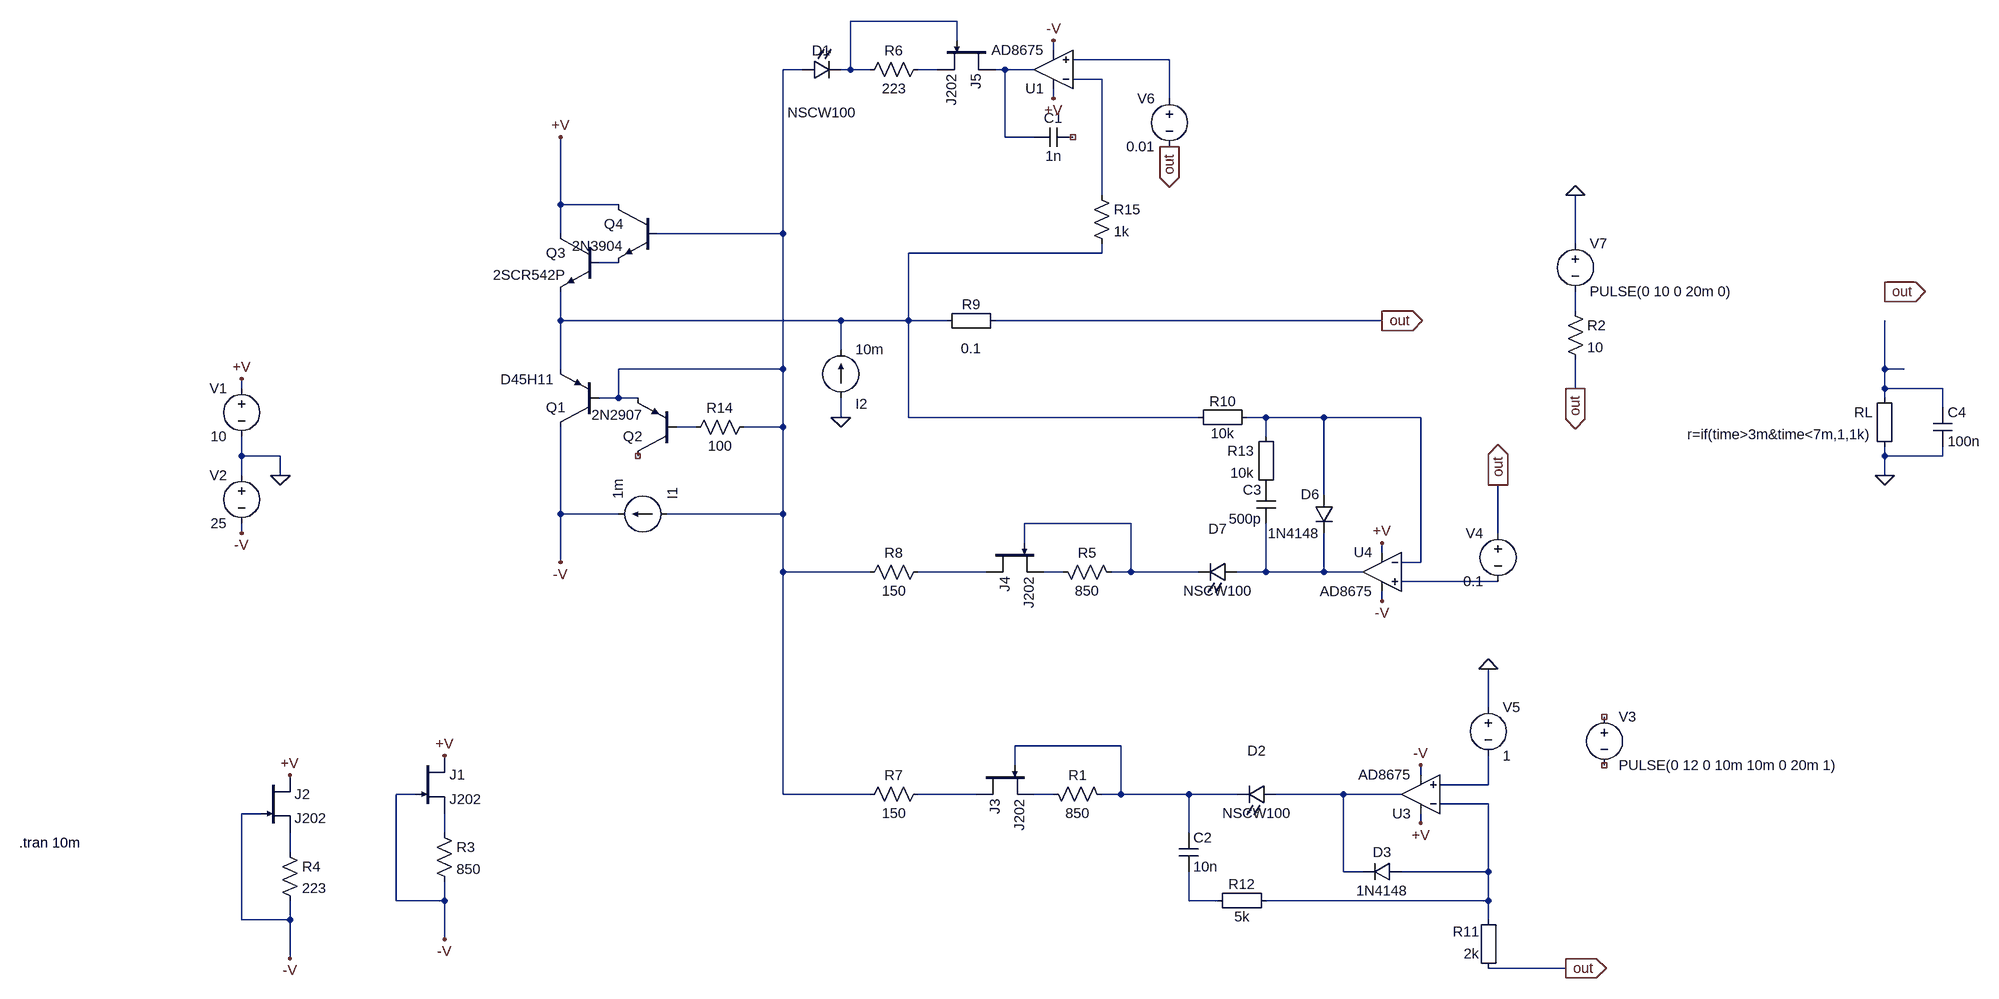
[diagram p0: schematic PSU CV CI high side I ref -reverted.asc]
PSU CV CI high side I ref -reverted.asc, the LTspice schematic file:
Version 4
SHEET 1 3544 2324
WIRE 1408 -368 1232 -368
WIRE 1408 -336 1408 -368
WIRE 1568 -320 1568 -336
WIRE 1760 -304 1600 -304
WIRE 1152 -288 1120 -288
WIRE 1232 -288 1232 -368
WIRE 1232 -288 1216 -288
WIRE 1264 -288 1232 -288
WIRE 1376 -288 1344 -288
WIRE 1488 -288 1472 -288
WIRE 1536 -288 1488 -288
WIRE 1648 -272 1600 -272
WIRE 1568 -240 1568 -256
WIRE 1760 -240 1760 -304
WIRE 1488 -176 1488 -288
WIRE 1536 -176 1488 -176
WIRE 1648 -80 1648 -272
WIRE 752 -64 752 -176
WIRE 848 -64 752 -64
WIRE 752 -16 752 -64
WIRE 1120 -16 1120 -288
WIRE 1120 -16 912 -16
WIRE 2432 0 2432 -80
WIRE 1648 16 1648 0
WIRE 1648 16 1328 16
WIRE 848 32 816 32
WIRE 2432 112 2432 80
WIRE 752 128 752 80
WIRE 1216 128 752 128
WIRE 1328 128 1328 16
WIRE 1328 128 1216 128
WIRE 1392 128 1328 128
WIRE 2112 128 1472 128
WIRE 1216 176 1216 128
WIRE 752 208 752 128
WIRE 1120 208 1120 -16
WIRE 1120 208 848 208
WIRE 2944 208 2944 128
WIRE 2976 208 2944 208
WIRE 224 240 224 224
WIRE 2432 240 2432 192
WIRE 2944 240 2944 208
WIRE 3040 240 2944 240
WIRE 848 256 848 208
WIRE 848 256 816 256
WIRE 880 256 848 256
WIRE 2944 256 2944 240
WIRE 3040 272 3040 240
WIRE 1216 288 1216 256
WIRE 1328 288 1328 128
WIRE 1808 288 1328 288
WIRE 1920 288 1888 288
WIRE 2016 288 1920 288
WIRE 2176 288 2016 288
WIRE 976 304 944 304
WIRE 1120 304 1120 208
WIRE 1120 304 1056 304
WIRE 1920 320 1920 288
WIRE 224 352 224 320
WIRE 288 352 224 352
WIRE 2944 352 2944 336
WIRE 3040 352 3040 336
WIRE 3040 352 2944 352
WIRE 224 384 224 352
WIRE 288 384 288 352
WIRE 2944 384 2944 352
WIRE 2016 416 2016 288
WIRE 752 448 752 304
WIRE 848 448 752 448
WIRE 1120 448 1120 304
WIRE 1120 448 928 448
WIRE 1696 464 1520 464
WIRE 224 480 224 464
WIRE 2304 480 2304 400
WIRE 1520 496 1520 464
WIRE 2112 512 2112 496
WIRE 752 528 752 448
WIRE 2176 528 2176 288
WIRE 2176 528 2144 528
WIRE 1120 544 1120 448
WIRE 1264 544 1120 544
WIRE 1456 544 1344 544
WIRE 1584 544 1552 544
WIRE 1696 544 1696 464
WIRE 1696 544 1664 544
WIRE 1808 544 1696 544
WIRE 1920 544 1920 464
WIRE 1920 544 1872 544
WIRE 2016 544 2016 480
WIRE 2016 544 1920 544
WIRE 2080 544 2016 544
WIRE 2304 560 2144 560
WIRE 2112 592 2112 576
WIRE 2288 768 2288 704
WIRE 1680 832 1504 832
WIRE 1504 864 1504 832
WIRE 2176 880 2176 864
WIRE 2288 896 2288 848
WIRE 2288 896 2208 896
WIRE 512 912 480 912
WIRE 1120 912 1120 544
WIRE 1264 912 1120 912
WIRE 1440 912 1344 912
WIRE 1568 912 1536 912
WIRE 1680 912 1680 832
WIRE 1680 912 1648 912
WIRE 1792 912 1680 912
WIRE 1872 912 1792 912
WIRE 2048 912 1936 912
WIRE 2144 912 2048 912
WIRE 2288 928 2208 928
WIRE 256 944 224 944
WIRE 2176 960 2176 944
WIRE 560 976 560 944
WIRE 1792 976 1792 912
WIRE 304 1008 304 976
WIRE 2048 1040 2048 912
WIRE 2080 1040 2048 1040
WIRE 2288 1040 2288 928
WIRE 2288 1040 2144 1040
WIRE 480 1088 480 912
WIRE 560 1088 560 1056
WIRE 560 1088 480 1088
WIRE 1792 1088 1792 1040
WIRE 1840 1088 1792 1088
WIRE 2288 1088 2288 1040
WIRE 2288 1088 1920 1088
WIRE 224 1120 224 944
WIRE 304 1120 304 1088
WIRE 304 1120 224 1120
WIRE 2288 1120 2288 1088
WIRE 560 1152 560 1088
WIRE 304 1184 304 1120
WIRE 2416 1200 2288 1200
FLAG 288 384 0
FLAG 224 224 +V
FLAG 2176 960 +V
FLAG 2112 496 +V
FLAG 224 480 -V
FLAG 2176 864 -V
FLAG 2112 592 -V
FLAG 2112 128 out
IOPIN 2112 128 Out
FLAG 2304 400 out
IOPIN 2304 400 Out
FLAG 2416 1200 out
IOPIN 2416 1200 Out
FLAG 752 528 -V
FLAG 2432 -80 0
FLAG 1568 -240 +V
FLAG 1568 -336 -V
FLAG 752 -176 +V
FLAG 1760 -160 out
IOPIN 1760 -160 Out
FLAG 560 848 +V
FLAG 560 1152 -V
FLAG 304 880 +V
FLAG 304 1184 -V
FLAG 1216 288 0
FLAG 2944 384 0
FLAG 2288 704 0
FLAG 2944 80 out
IOPIN 2944 80 Out
FLAG 2432 240 out
IOPIN 2432 240 Out
SYMBOL voltage 224 224 M0
WINDOW 123 0 0 Left 0
WINDOW 39 0 0 Left 0
SYMATTR InstName V1
SYMATTR Value 10
SYMBOL Misc\\EuropeanResistor 1376 144 R270
WINDOW 0 27 56 VTop 2
WINDOW 3 -14 56 VBottom 2
SYMATTR InstName R9
SYMATTR Value 0.1
SYMBOL voltage 2480 768 R0
WINDOW 123 0 0 Left 0
WINDOW 39 0 0 Left 0
SYMATTR InstName V3
SYMATTR Value PULSE(0 12 0 10m 10m 0 20m 1)
SYMBOL voltage 2304 464 M0
WINDOW 123 0 0 Left 0
WINDOW 39 0 0 Left 0
SYMATTR InstName V4
SYMATTR Value 0.1
SYMBOL current 928 448 M270
WINDOW 123 0 0 Left 0
WINDOW 39 24 108 Left 2
WINDOW 0 24 -10 Left 2
SYMATTR InstName I1
SYMATTR Value 1m
SYMBOL Misc\\EuropeanResistor 2960 240 M0
SYMATTR InstName RL
SYMATTR Value r=if(time>3m&time<7m,1,1k)
SYMBOL voltage 224 368 M0
WINDOW 123 0 0 Left 0
WINDOW 39 0 0 Left 0
SYMATTR InstName V2
SYMATTR Value 25
SYMBOL diode 2144 1056 M270
WINDOW 0 32 32 VTop 2
WINDOW 3 0 32 VBottom 2
SYMATTR InstName D3
SYMATTR Value 1N4148
SYMBOL Misc\\EuropeanResistor 2304 1216 R180
WINDOW 0 31 76 Left 2
WINDOW 3 31 40 Left 2
SYMATTR InstName R11
SYMATTR Value 2k
SYMBOL Misc\\EuropeanResistor 1792 304 R270
WINDOW 0 27 56 VTop 2
WINDOW 3 5 56 VBottom 2
SYMATTR InstName R10
SYMATTR Value 10k
SYMBOL cap 1776 976 R0
SYMATTR InstName C2
SYMATTR Value 10n
SYMBOL Misc\\EuropeanResistor 1824 1104 R270
WINDOW 0 27 56 VTop 2
WINDOW 3 5 56 VBottom 2
SYMATTR InstName R12
SYMATTR Value 5k
SYMBOL cap 1936 400 M0
SYMATTR InstName C3
SYMATTR Value 500p
SYMBOL Misc\\EuropeanResistor 1936 304 M0
SYMATTR InstName R13
SYMATTR Value 10k
SYMBOL diode 2032 416 M0
SYMATTR InstName D6
SYMATTR Value 1N4148
SYMBOL Opamps\\AD8675 2112 480 M0
SYMATTR InstName U4
SYMBOL cap 3024 272 R0
SYMATTR InstName C4
SYMATTR Value 100n
SYMBOL LED 1872 560 M270
WINDOW 0 72 32 VTop 2
WINDOW 3 0 32 VBottom 2
SYMATTR InstName D7
SYMATTR Value NSCW100
SYMATTR Description Diode
SYMATTR Type diode
SYMBOL pnp 816 304 R180
WINDOW 3 75 79 Left 2
SYMATTR Value D45H11
SYMATTR InstName Q1
SYMBOL LED 1936 928 M270
WINDOW 0 72 32 VTop 2
WINDOW 3 0 32 VBottom 2
SYMATTR InstName D2
SYMATTR Value NSCW100
SYMATTR Description Diode
SYMATTR Type diode
SYMBOL voltage 2432 -16 R0
WINDOW 123 0 0 Left 0
WINDOW 39 0 0 Left 0
SYMATTR InstName V7
SYMATTR Value PULSE(0 10 0 20m 0)
SYMBOL res 2416 96 R0
SYMATTR InstName R2
SYMATTR Value 10
SYMBOL Opamps\\AD8675 1568 -224 R180
SYMATTR InstName U1
SYMBOL npn 816 -16 M0
SYMATTR InstName Q3
SYMATTR Value 2SCR542P
SYMBOL voltage 1760 -256 M0
WINDOW 123 0 0 Left 0
WINDOW 39 0 0 Left 0
SYMATTR InstName V6
SYMATTR Value 0.01
SYMBOL njf 512 848 R0
SYMATTR InstName J1
SYMATTR Value J202
SYMBOL res 544 960 R0
SYMATTR InstName R3
SYMATTR Value 850
SYMBOL njf 256 880 R0
SYMATTR InstName J2
SYMATTR Value J202
SYMBOL res 288 992 R0
SYMATTR InstName R4
SYMATTR Value 223
SYMBOL njf 1440 864 M90
SYMATTR InstName J3
SYMATTR Value J202
SYMBOL res 1552 896 M90
WINDOW 0 0 56 VBottom 2
WINDOW 3 32 56 VTop 2
SYMATTR InstName R1
SYMATTR Value 850
SYMBOL njf 1456 496 M90
SYMATTR InstName J4
SYMATTR Value J202
SYMBOL res 1568 528 M90
WINDOW 0 0 56 VBottom 2
WINDOW 3 32 56 VTop 2
SYMATTR InstName R5
SYMATTR Value 850
SYMBOL njf 1472 -336 R90
SYMATTR InstName J5
SYMATTR Value J202
SYMBOL res 1360 -304 R90
WINDOW 0 0 56 VBottom 2
WINDOW 3 32 56 VTop 2
SYMATTR InstName R6
SYMATTR Value 223
SYMBOL npn 912 -64 M0
SYMATTR InstName Q4
SYMATTR Value 2N3904
SYMBOL LED 1152 -304 M90
WINDOW 0 0 32 VBottom 2
WINDOW 3 72 32 VTop 2
SYMATTR InstName D1
SYMATTR Value NSCW100
SYMATTR Description Diode
SYMATTR Type diode
SYMBOL pnp 944 352 R180
SYMATTR InstName Q2
SYMATTR Value 2N2907
SYMBOL current 1216 256 M180
WINDOW 123 0 0 Left 0
WINDOW 39 24 108 Left 2
WINDOW 0 24 -10 Left 2
SYMATTR InstName I2
SYMATTR Value 10m
SYMBOL res 1360 896 R90
WINDOW 0 0 56 VBottom 2
WINDOW 3 32 56 VTop 2
SYMATTR InstName R7
SYMATTR Value 150
SYMBOL Opamps\\AD8675 2176 976 R180
SYMATTR InstName U3
SYMBOL res 1360 528 R90
WINDOW 0 0 56 VBottom 2
WINDOW 3 32 56 VTop 2
SYMATTR InstName R8
SYMATTR Value 150
SYMBOL res 1072 288 R90
WINDOW 0 0 56 VBottom 2
WINDOW 3 32 56 VTop 2
SYMATTR InstName R14
SYMATTR Value 100
SYMBOL res 1632 -96 R0
SYMATTR InstName R15
SYMATTR Value 1k
SYMBOL cap 1600 -192 R90
WINDOW 0 0 32 VBottom 2
WINDOW 3 32 32 VTop 2
SYMATTR InstName C1
SYMATTR Value 1n
SYMBOL voltage 2288 752 R0
WINDOW 123 0 0 Left 0
WINDOW 39 0 0 Left 0
SYMATTR InstName V5
SYMATTR Value 1
TEXT -144 992 Left 2 !.tran 10m

The netlist it stands for:
* PSU CV CI high side I ref -reverted.asc
V1 +V 0 10
R9 N007 out 0.1
V3 NC_01 NC_02 PULSE(0 12 0 10m 10m 0 20m 1)
V4 out N017 0.1
I1 N003 -V 1m
RL N010 0 r=if(time>3m&time<7m,1,1k)
V2 0 -V 25
D3 N023 N022 1N4148
R11 out N023 2k
R10 N007 N011 10k
C2 N018 N026 10n
R12 N026 N023 5k
C3 P001 N016 500p
R13 N011 P001 10k
D6 N011 N016 1N4148
XU4 N017 N011 +V -V N016 AD8675  ; pins In+ In- V+ V- OUT
C4 N010 0 100n
D7 N016 N013 NSCW100
Q1 -V N003 N007 0 D45H11
D2 N022 N018 NSCW100
V7 0 N009 PULSE(0 10 0 20m 0)
R2 N009 out 10
XU1 N002 N006 +V -V N005 AD8675  ; pins In+ In- V+ V- OUT
Q3 +V N008 N007 0 2SCR542P
V6 N002 out 0.01
J1 +V -V N024 J202
R3 N024 -V 850
J2 +V -V N025 J202
R4 N025 -V 223
J3 N020 N018 N021 J202
R1 N021 N018 850
J4 N014 N013 N015 J202
R5 N015 N013 850
J5 N005 N001 N004 J202
R6 N004 N001 223
Q4 +V N003 N008 0 2N3904
D1 N003 N001 NSCW100
Q2 NC_03 N012 N003 0 2N2907
I2 0 N007 10m
R7 N020 N003 150
XU3 N019 N023 +V -V N022 AD8675  ; pins In+ In- V+ V- OUT
R8 N014 N003 150
R14 N003 N012 100
R15 N006 N007 1k
C1 NC_04 N005 1n
V5 0 N019 1
.model D D
.lib standard.dio
.model NPN NPN
.model PNP PNP
.lib standard.bjt
.model NJF NJF
.model PJF PJF
.lib standard.jft
.tran 10m
.backanno
.end